# EAGLE design picoAvaR8 (EAGLE 6.1)
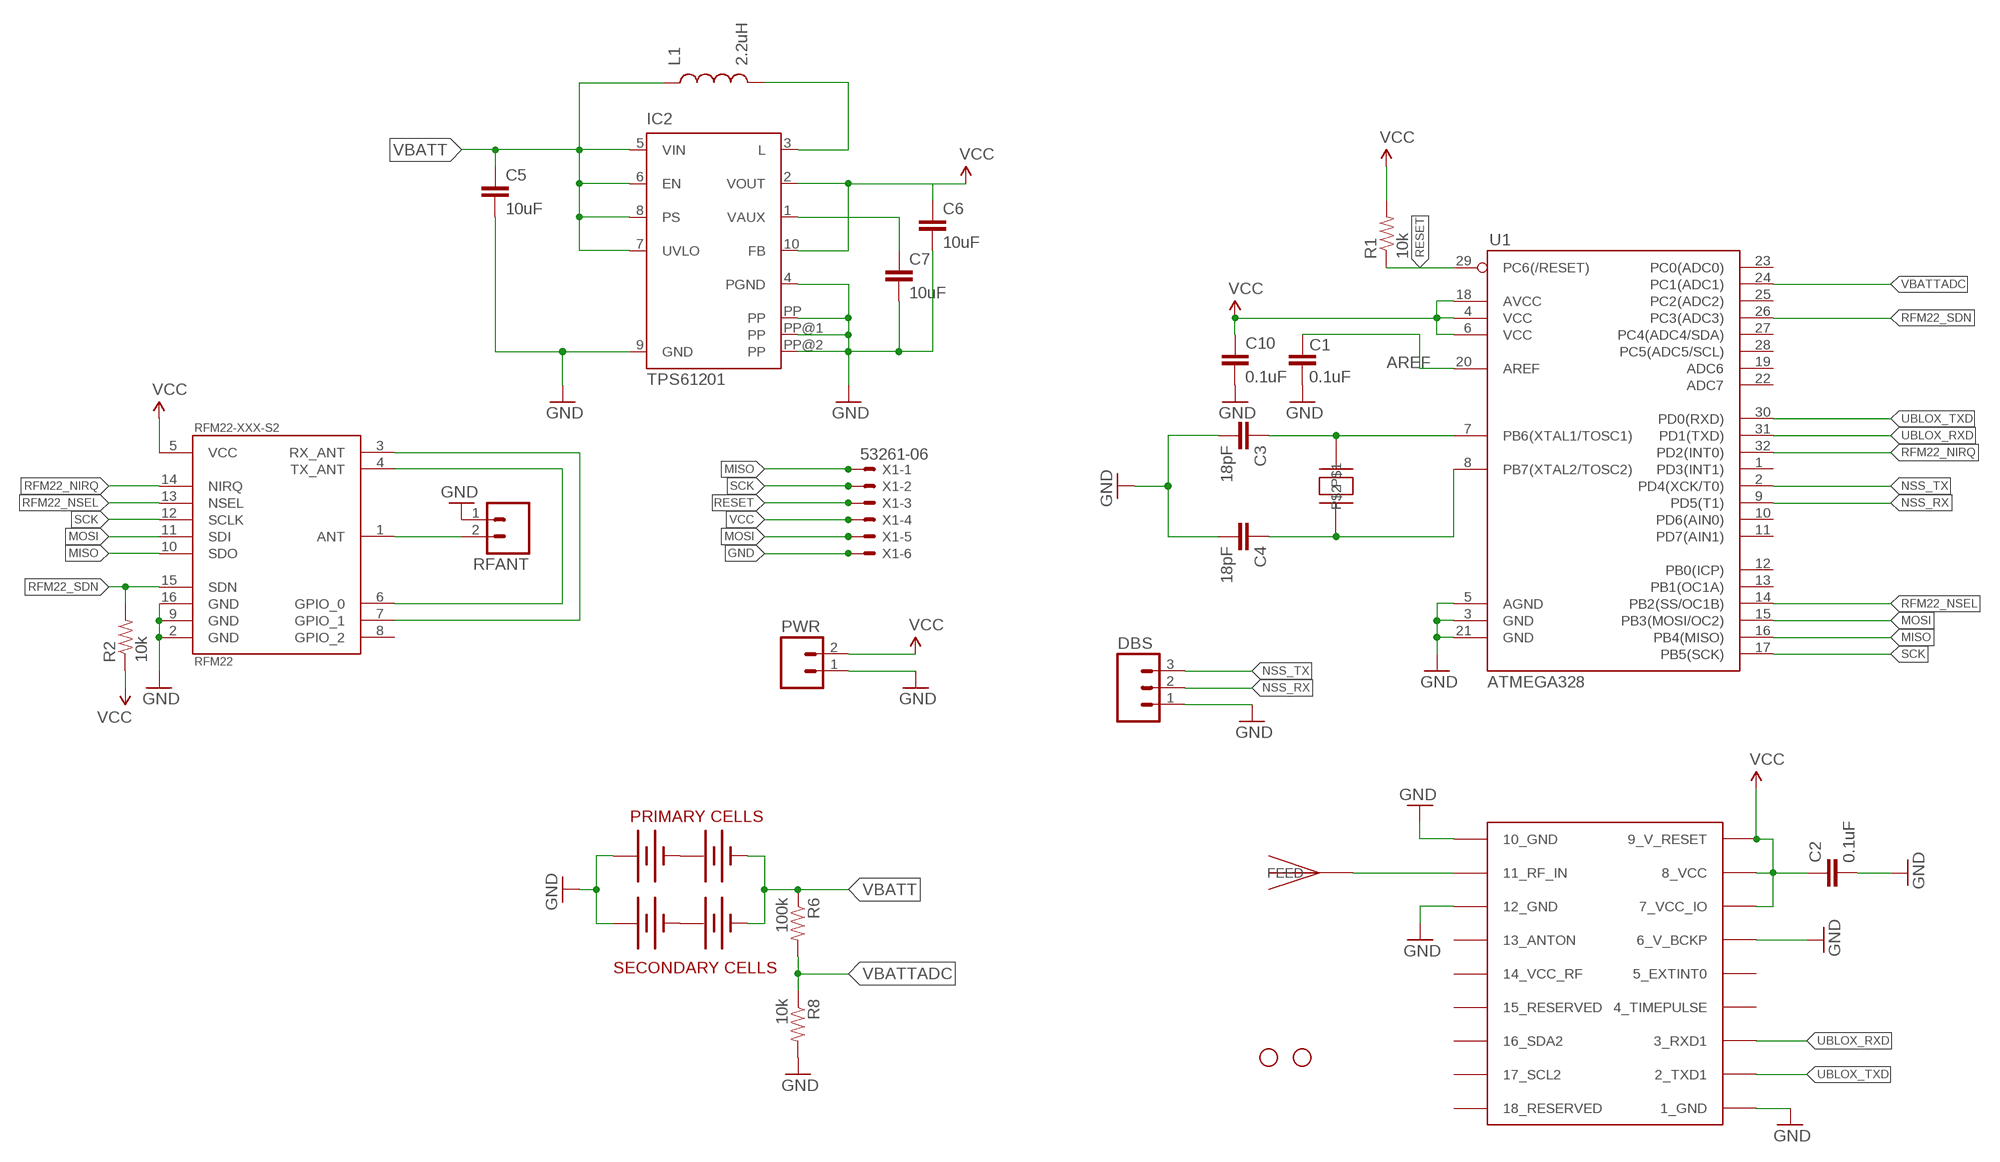
[diagram p0: schematic, sheet 1]

## Parts
C1  0.1uF  CAP0402-CAP  [0402-CAP]
C2  0.1uF  CAP0402-CAP  [0402-CAP]
C3  18pF  CAP0402-CAP  [0402-CAP]
C4  18pF  CAP0402-CAP  [0402-CAP]
C5  10uF  CAP1206  [1206]
C6  10uF  CAP1206  [1206]
C7  10uF  CAP1206  [1206]
C10  0.1uF  CAP0402-CAP  [0402-CAP]
DBS  M03PTH  [1X03]
IC2  TPS61201  [S-PDSO-N10]
JP1  STAND-OFF  [STAND-OFF]
JP2  STAND-OFF  [STAND-OFF]
L1  2.2uH  ELLVGG_INDUCTOR  [ELLVGG_INDUCTOR]
PC1  PC1  TEST  [TEST]
PC2  TEST  [TEST]
PWR  M02PTH  [1X02]
R1  10k  RESISTOR0402-RES  [0402-RES]
R2  10k  RESISTOR0402-RES  [0402-RES]
R6  100k  RESISTOR0402-RES  [0402-RES]
R8  10k  RESISTOR0402-RES  [0402-RES]
RFANT  M02PTH  [1X02]
RFM22-XXX-S2  RFM22  [RFM22-XXX-S2]
SC1  TEST  [TEST]
SC2  TEST  [TEST]
U1  ATMEGA328  ATMEGA168  [TQFP32-08]
U$1  UBLOX_MAX-6  [UBLOX_MAX-6]
U$2  ABRACON_ABM3_CRYSTAL  [ABRACON_ABM3_CRYSTAL]
U$3  JTI_ANTENNA-1575AT43A40  [JTI_ANTENNA-1575AT43A40]
X1  53261-06  [53261-06]

## Nets
AREF: C1.2 U1.20(AREF)
GND [vcc]: C1.1 C2.2 C3.2 C4.2 C5.2 C6.2 C7.2 C10.2 DBS.1 IC2.4(PGND) IC2.9(GND) IC2.PP IC2.PP@1(PP) IC2.PP@2(PP) PC1.VBATT1(+) PC1.VBATT(+) PWR.1 R8.2 RFANT.1 RFM22-XXX-S2.2(GND) RFM22-XXX-S2.9(GND) RFM22-XXX-S2.16(GND) SC1.VBATT1(+) SC1.VBATT(+) U1.3(GND) U1.5(AGND) U1.21(GND) U$1.1_GND U$1.6_V_BCKP U$1.10_GND U$1.12_GND X1.6
MISO: RFM22-XXX-S2.10(SDO) U1.16(PB4(MISO)) X1.1
MOSI: RFM22-XXX-S2.11(SDI) U1.15(PB3(MOSI/OC2)) X1.5
N$2: SC1.GND2(-) SC1.GND(-) SC2.VBATT1(+) SC2.VBATT(+)
N$3: RFANT.2 RFM22-XXX-S2.1(ANT)
N$4: U$1.11_RF_IN U$3.FEED
N$5: RFM22-XXX-S2.3(RX_ANT) RFM22-XXX-S2.7(GPIO_1)
N$6: RFM22-XXX-S2.4(TX_ANT) RFM22-XXX-S2.6(GPIO_0)
N$7: IC2.3(L) L1.P$2
N$8: PC1.GND2(-) PC1.GND(-) PC2.VBATT1(+) PC2.VBATT(+)
N$9: C3.1 U1.7(PB6(XTAL1/TOSC1)) U$2.P$2
N$10: C4.1 U1.8(PB7(XTAL2/TOSC2)) U$2.P$1
N$11: C7.1 IC2.1(VAUX)
NSS_RX: DBS.2 U1.9(PD5(T1))
NSS_TX: DBS.3 U1.2(PD4(XCK/T0))
RESET: R1.1 U1.29(PC6(/RESET)) X1.3
RFM22_NIRQ: RFM22-XXX-S2.14(NIRQ) U1.32(PD2(INT0))
RFM22_NSEL: RFM22-XXX-S2.13(NSEL) U1.14(PB2(SS/OC1B))
RFM22_SDN: R2.2 RFM22-XXX-S2.15(SDN) U1.26(PC3(ADC3))
SCK: RFM22-XXX-S2.12(SCLK) U1.17(PB5(SCK)) X1.2
UBLOX_RXD: U1.31(PD1(TXD)) U$1.3_RXD1
UBLOX_TXD: U1.30(PD0(RXD)) U$1.2_TXD1
VBATT [vcc]: C5.1 IC2.5(VIN) IC2.6(EN) IC2.7(UVLO) IC2.8(PS) L1.P$1 PC2.GND2(-) PC2.GND(-) R6.1 SC2.GND2(-) SC2.GND(-)
VBATTADC: R6.2 R8.1 U1.24(PC1(ADC1))
VCC: C2.1 C6.1 C10.1 IC2.2(VOUT) IC2.10(FB) PWR.2 R1.2 R2.1 RFM22-XXX-S2.5(VCC) U1.4(VCC) U1.6(VCC) U1.18(AVCC) U$1.7_VCC_IO U$1.8_VCC U$1.9_V_RESET X1.4
Unconnected: RFM22-XXX-S2.8(GPIO_2) U1.1(PD3(INT1)) U1.10(PD6(AIN0)) U1.11(PD7(AIN1)) U1.12(PB0(ICP)) U1.13(PB1(OC1A)) U1.19(ADC6) U1.22(ADC7) U1.23(PC0(ADC0)) U1.25(PC2(ADC2)) U1.27(PC4(ADC4/SDA)) U1.28(PC5(ADC5/SCL)) U$1.4_TIMEPULSE U$1.5_EXTINT0 U$1.13_ANTON U$1.14_VCC_RF U$1.15_RESERVED U$1.16_SDA2 U$1.17_SCL2 U$1.18_RESERVED

## Notes on the sheet
- PRIMARY CELLS
- SECONDARY CELLS

## Library data of the parts
C1-C7 C10 = SparkFun:CAP: Capacitor Standard 0603 ceramic capacitor, and 0.1" leaded capacitor.
DBS = SparkFun:M03: Header 3 Standard 3-pin 0.1" header. Use with straight break away headers (SKU : PRT-00116), right angle break away headers (PRT-00553), swiss pins (PRT-00743), machine pins (PRT-00117), and female headers (PRT-00115). Molex polarized connector foot print use with SKU : PRT-08232 with associated crimp pins and housings.
IC2 = texas:TPS6120*: LOW INPUT VOLTAGE SYNCHRONOUS BOOST CONVERTER WITH 1.3-A SWITCHES Source: http://focus.ti.com/lit/ds/symlink/tps61200.pdf; MPN: TPS61201DRCT; OC_FARNELL: unknown; OC_NEWARK: 37M0068
JP1 JP2 = SparkFun:STAND-OFF: Stand Off This is the mechanical footprint for a #4 phillips button head screw. Use the keepout ring to avoid running the screw head into surrounding components. SKU : PRT-00447
L1 = ava:ELLVGG_INDUCTOR
PC1 PC2 SC1 SC2 = ava:TEST
PWR RFANT = SparkFun:M02: Header 2 Standard 2-pin 0.1" header. Use with straight break away headers (SKU : PRT-00116), right angle break away headers (PRT-00553), swiss pins (PRT-00743), machine pins (PRT-00117), and female headers (PRT-00115). Molex polarized connector foot print use with SKU : PRT-08233 with associated crimp pins and housings.
R1 R2 R6 R8 = SparkFun:RESISTOR: Resistor Basic schematic elements and footprints for 0603, 1206, and PTH resistors.
RFM22-XXX-S2 = SparkFun:RFM22: *Hope RF's RFM22* Packages: RFM22-S2 (SMD)
U1 = SparkFun:ATMEGA168
U$1 = ava:UBLOX_MAX-6: UBLOX MAX-6
U$2 = ava:ABRACON_ABM3_CRYSTAL
U$3 = ava:JTI_ANTENNA-1575AT43A40
X1 = con-molex:53?-06: CONNECTOR wire to board 1.25 mm (.049 inch) pitch header; OC_FARNELL: 1125375; OC_NEWARK: unknown

## Net classes
0 default: width 0.203 mm
1 vcc: width 0.254 mm

## Board
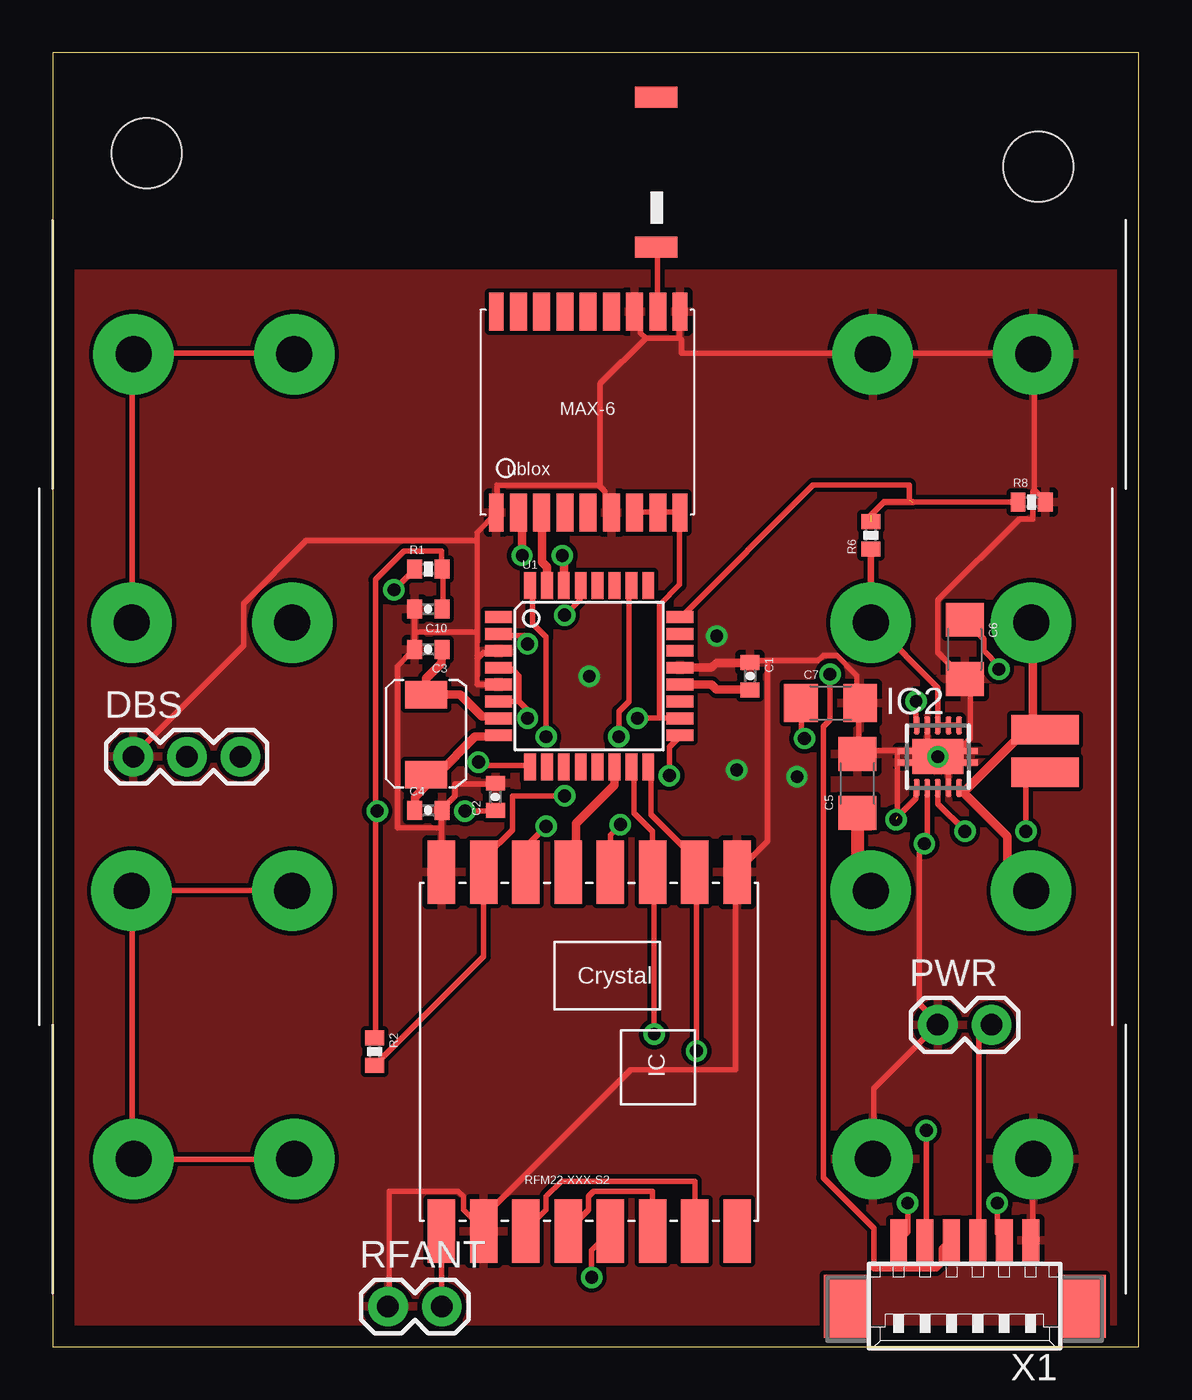
[diagram p1: board, top side]
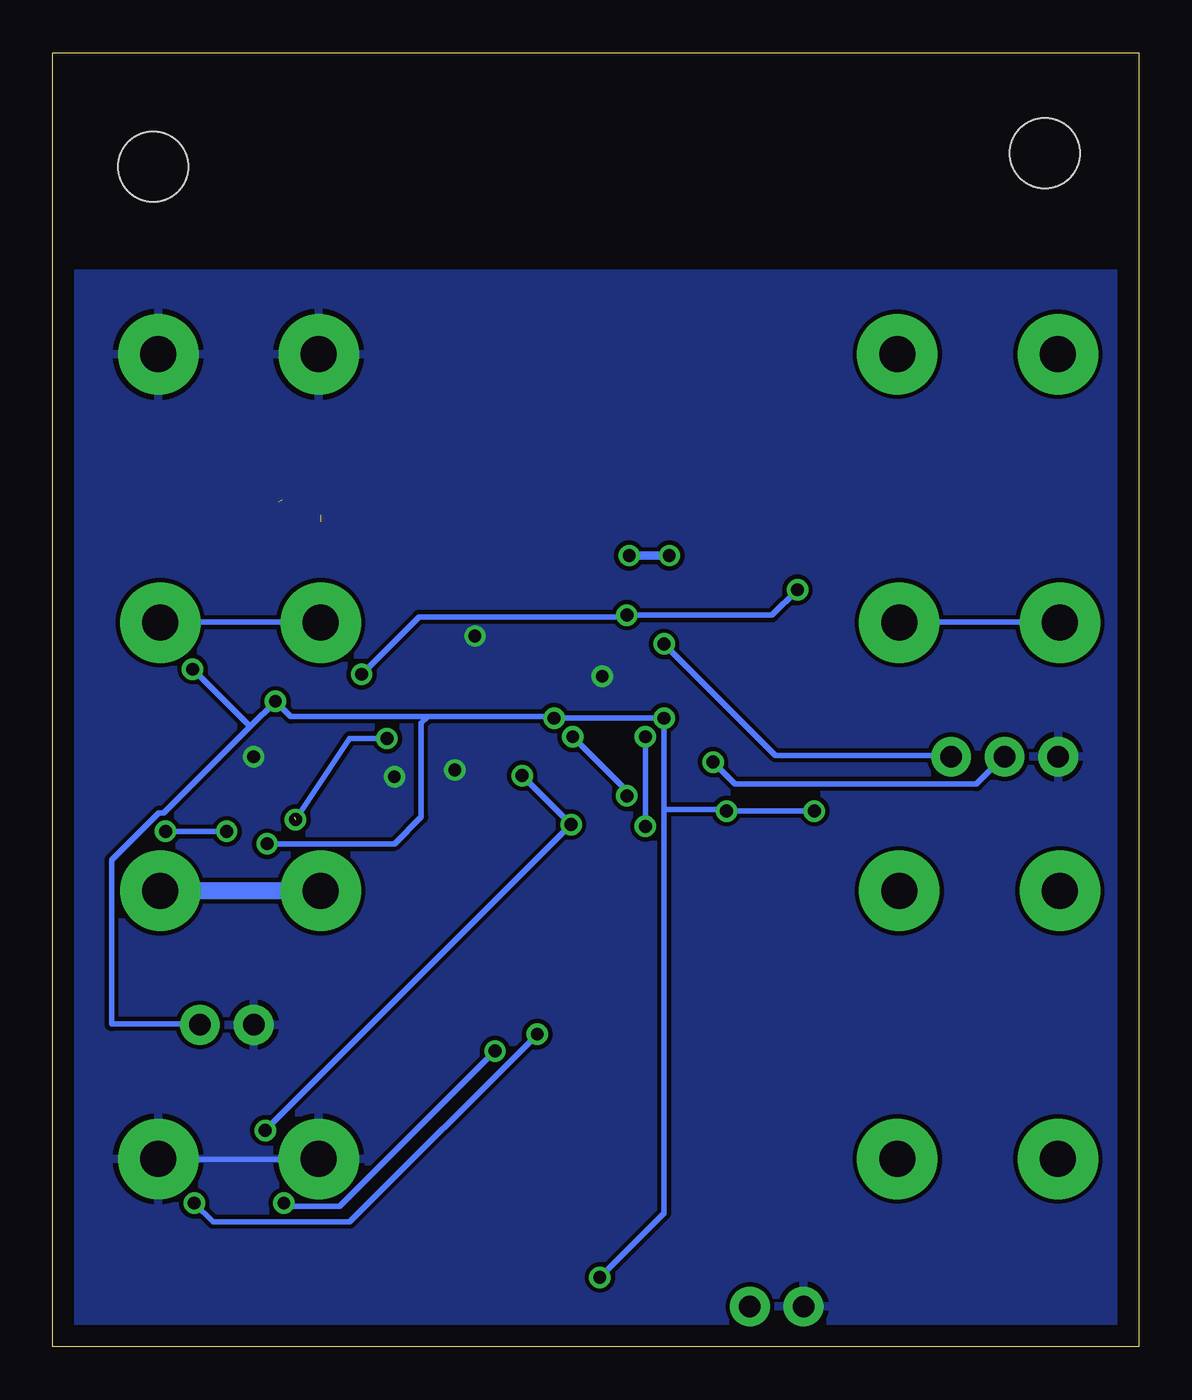
[diagram p2: board, bottom side, seen from below]

Size 51.42 x 61.27 mm. Coordinates in mm from the lower left corner, seen from the top.
Outline: 0,0 51.42,0 51.42,61.27 0,61.27 0,0
Copper layers (1*16): Top 0.035mm / dielectric 1.5mm / Bottom 0.035mm
Design rules: minimum track width 10mil, minimum drill 24mil, track to track 8mil, track to pad 8mil, pad to pad 8mil, via to via 8mil, smd to smd 8mil, copper to edge 40mil, drill to drill 8mil, minimum pad ring 10mil, minimum via ring 8mil, stop-mask expansion 4mil, vias tented up to drill 0mil, thermal gap 10mil

### Footprints (pad centres in the part's own frame; a part is rotated, then mirrored left to right if it is on the bottom)
0402-CAP = smd 0.7 x 0.9: 1 -0.65,0; 2 0.65,0
1206 = smd 1.6 x 1.8: 1 -1.4,0; 2 1.4,0
1X03 = drill 1.016 pad 1.88: 1 0,0; 2 2.54,0; 3 5.08,0
S-PDSO-N10 = smd 0.28 x 0.85: 1 -1,-1.475; 2 -0.5,-1.475; 3 0,-1.475; 4 0.5,-1.475; 5 1,-1.475; 6 1,1.475; 7 0.5,1.475; 8 0,1.475; 9 -0.5,1.475; 10 -1,1.475 | smd 2.4 x 1.65: PP 0,0 | smd 3.8 x 0.28: PP@1 0,0.275; PP@2 0,-0.275
STAND-OFF = hole 3.302: 0,0
ELLVGG_INDUCTOR = smd 1.4 x 3.2: P$1 -3.81,0; P$2 -1.81,0
TEST = drill 1.7 pad 3.81: GND -21.57,0; GND2 -13.97,0; VBATT 13.43,0; VBATT1 21.03,0
1X02 = drill 1.016 pad 1.88: 1 0,0; 2 2.54,0
0402-RES = smd 0.7 x 0.9: 1 -0.65,0; 2 0.65,0
RFM22-XXX-S2 = smd 3 x 1.3: 1 -8.5,7; 2 -8.5,5; 3 -8.5,3; 4 -8.5,1; 5 -8.5,-1; 6 -8.5,-3; 7 -8.5,-5; 8 -8.5,-7; 9 8.5,-7; 10 8.5,-5; 11 8.5,-3; 12 8.5,-1; 13 8.5,1; 14 8.5,3; 15 8.5,5; 16 8.5,7
TQFP32-08 = smd 1.27 x 0.559: 1 -4.293,2.8; 2 -4.293,2; 3 -4.293,1.2; 4 -4.293,0.4; 5 -4.293,-0.4; 6 -4.293,-1.2; 7 -4.293,-2; 8 -4.293,-2.8; 17 4.293,-2.8; 18 4.293,-2; 19 4.293,-1.2; 20 4.293,-0.4; 21 4.293,0.4; 22 4.293,1.2; 23 4.293,2; 24 4.293,2.8 | smd 0.559 x 1.27: 9 -2.8,-4.293; 10 -2,-4.293; 11 -1.2,-4.293; 12 -0.4,-4.293; 13 0.4,-4.293; 14 1.2,-4.293; 15 2,-4.293; 16 2.8,-4.293; 25 2.8,4.293; 26 2,4.293; 27 1.2,4.293; 28 0.4,4.293; 29 -0.4,4.293; 30 -1.2,4.293; 31 -2,4.293; 32 -2.8,4.293
UBLOX_MAX-6 = smd 1.8 x 0.7: 1_GND 4.95,-4.4; 9_V_RESET 4.95,4.3; 10_GND -4.55,4.3; 18_RESERVED -4.55,-4.4 | smd 1.8 x 0.8: 2_TXD1 4.95,-3.35; 3_RXD1 4.95,-2.25; 4_TIMEPULSE 4.95,-1.15; 5_EXTINT0 4.95,-0.05; 6_V_BCKP 4.95,1.05; 7_VCC_IO 4.95,2.15; 8_VCC 4.95,3.25; 11_RF_IN -4.55,3.25; 12_GND -4.55,2.15; 13_ANTON -4.55,1.05; 14_VCC_RF -4.55,-0.05; 15_RESERVED -4.55,-1.15; 16_SDA2 -4.55,-2.25; 17_SCL2 -4.55,-3.35
ABRACON_ABM3_CRYSTAL = smd 1.3 x 2: P$1 -3.4,0.1; P$2 0.4,0.1
JTI_ANTENNA-1575AT43A40 = smd 1 x 2: FEED -3.81,-1.27; NC 3.29,-1.27
53261-06 = smd 0.8 x 2: 1 3.125,-2.5; 2 1.875,-2.5; 3 0.625,-2.5; 4 -0.625,-2.5; 5 -1.875,-2.5; 6 -3.125,-2.5 | smd 2.1 x 3: S1 5.625,0.625; S2 -5.625,0.625

### Placement (x,y rotation side)
C1  33.02,31.75 270 top
C2  20.95,26.04 90 top
C3  17.78,33.02 180 top
C4  17.78,25.4 0 top
C5  38.1,26.67 90 top
C6  43.18,33.02 270 top
C7  36.83,30.48 0 top
C10  17.78,34.92 180 top
DBS  3.81,27.94 0 top
IC2  41.91,27.94 0 top
JP1  4.45,56.52 0 top
JP2  46.67,55.88 0 top
L1  46.99,25.4 270 top
PC1  25.4,8.89 0 top
PC2  24.77,21.59 180 top
PWR  41.91,15.24 0 top
R1  17.78,36.83 0 top
R2  15.24,13.97 270 top
R6  38.73,38.42 90 top
R8  46.35,40.01 0 top
RFANT  15.88,1.91 0 top
RFM22-XXX-S2  25.4,13.97 90 top
SC1  25.4,46.99 0 top
SC2  24.77,34.29 180 top
U1  25.4,31.75 0 top
U$1  25.4,44.45 270 top
U$2  17.78,30.48 90 top
U$3  27.3,55.88 90 top
X1  43.18,2.54 180 top

### Tracks (layer width: path | path; a pad name or v marks a point on that pad's centre or on a via)
AREF
  Top 0.406: U1.20 31.2,31.35 31.43,31.11 33.01,31.11 C1.2
GND  (via drill 0.6)
  Top 0.254: X1.6 46.32,5.04 46.4,5.12 46.4,8.88 PC1.VBATT1 | PC1.VBATT 38.88,8.96 38.88,12.24 41.84,15.2 PWR.1 41.92,15.36 41.04,16.24 41.04,23.92 | RFANT.1 15.92,1.92 15.92,7.36 19.2,7.36 19.44,7.12 19.44,6.48 20.4,5.52 RFM22-XXX-S2.2 20.16,5.92 27.36,13.12 32.32,13.12 32.32,22.4 RFM22-XXX-S2.9 33.84,23.92 33.84,32.48 | IC2.4 42.4,26.48 42.4,27.12 41.92,27.6 IC2.PP | IC2.PP 42.16,27.52 43.44,28.8 43.44,31.36 C6.2 41.92,32.88 41.92,35.36 45.76,39.2 46.4,39.2 46.4,40.48 46.48,40.56 | IC2.PP@2 IC2.PP | IC2.PP@1 41.92,28.16 41.92,28 IC2.PP | 33.84,32.48 36.24,32.48 36.48,32.72 37.12,32.72 38.08,31.76 38.08,30.56 C7.2 38.16,30.48 38.16,28.08 C5.2 38.24,28.24 40,28.24 | 33.84,32.48 33.2,32.48 C1.1 | 40,28.24 41.84,28.24 IC2.PP@1 | 40,28.24 40,24.96 | 46.48,40.56 46.96,40.08 R8.2 | 46.48,40.56 46.48,46.96 SC1.VBATT1 46.32,47.04 38.88,47.04 SC1.VBATT 38.72,47.04 29.76,47.04 29.76,47.68 29.68,47.76 | RFM22-XXX-S2.16 18.4,24.56 | 18.4,24.56 18.4,25.36 C4.2 18.48,25.52 19.04,26.08 19.04,26.64 20.88,26.64 C2.2 | 28.08,47.76 27.84,48 27.84,48.72 27.6,48.96 U$1.12_GND | 29.68,47.76 28.08,47.76 | 29.68,47.76 29.68,48.96 U$1.10_GND | 17.12,33.84 17.12,34.88 C10.2 | 17.12,33.84 17.12,33.04 C3.2 17.04,32.96 16.32,32.24 16.32,24.56 18.4,24.56 | 20.16,32.64 20.4,32.88 21.04,32.88 U1.3 | 20.16,32.64 20.08,32.56 20.08,31.36 21.04,31.36 U1.5 | 20.08,33.84 17.12,33.84 | 20.08,33.84 20.08,32.72 20.16,32.64 | 20.08,33.84 20.08,38.16 | 20.08,38.16 20.08,38.56 20.96,39.44 U$1.1_GND 21.04,39.6 21.04,40.8 25.84,40.8 | 25.84,40.8 26.16,40.48 26.16,39.76 26.4,39.52 U$1.6_V_BCKP | 28.08,47.76 25.92,45.6 25.92,40.88 25.84,40.8
  Top 0.254: 20.08,38.16 12,38.16 9.04,35.2 9.04,33.2 3.84,28 DBS.1 | IC2.9 41.41,28.71 IC2.PP@1
  Top 0.406: U1.21 31.2,32.15 31.43,32.38 33.01,32.38 C1.1
  Bottom 0.254: PC1.VBATT1 46.4,8.88 38.88,8.88 PC1.VBATT
  other vias: 31.43,33.66 25.4,31.75 32.38,27.3 35.24,26.99 41.91,27.94
  pour Top: 0.32,50.8 50.8,50.8 50.8,0 0.32,0
  pour Bottom: 0.32,50.8 50.8,50.8 50.8,0 0.32,0
MISO  (via drill 0.61)
  Top 0.254: U1.16 28.24,27.44 28.32,27.36 28.32,25.2 30.4,23.12 RFM22-XXX-S2.10 30.48,22.4 v30.48,14 | v40.48,6.8 40.48,5.44 40.08,5.04 X1.1
  Bottom 0.254: v40.48,6.8 40.32,6.64 37.84,6.64 v30.48,14
MOSI  (via drill 0.61)
  Top 0.254: U1.15 27.44,27.44 27.52,27.36 27.52,25.28 28.4,24.4 RFM22-XXX-S2.11 28.48,22.4 v28.48,14.8 | v44.72,6.8 44.72,5.36 X1.5
  Bottom 0.254: v44.72,6.8 43.84,5.92 37.36,5.92 v28.48,14.8
N$2
  Top 0.254: SC1.GND2 11.36,47.04 3.84,47.04 SC1.GND 3.76,46.88 3.76,34.32 SC2.VBATT1
  Bottom 0.254: SC2.VBATT1 3.76,34.32 11.28,34.32 SC2.VBATT
N$3
  Top 0.254: RFM22-XXX-S2.1 RFANT.2
N$4
  Top 0.254: U$1.11_RF_IN 28.64,49.04 28.64,52 U$3.FEED
N$5
  Top 0.254: RFM22-XXX-S2.7 30.4,7.84 24.08,7.84 23.36,7.12 23.36,6.48 22.4,5.52 RFM22-XXX-S2.3
N$6
  Top 0.254: RFM22-XXX-S2.6 28.4,7.36 25.6,7.36 25.36,7.12 25.36,6.48 24.4,5.52 RFM22-XXX-S2.4
N$7  (via drill 0.61)
  Top 0.254: v46.08,24.4 46.08,27.12 46.16,27.2 46.96,27.2 L1.P$2 | IC2.3 41.92,26.4 41.92,25.71 43.19,24.44 v43.19,24.4
  Bottom 0.254: v46.08,24.4 v43.19,24.4
N$8
  Top 0.254: PC2.VBATT 11.28,21.6 3.76,21.6 PC2.VBATT1 3.76,21.52 3.76,8.96 PC1.GND 11.36,8.88 PC1.GND2
N$9
  Top 0.254: U1.7 20.95,29.84
  Top 0.406: 20.95,29.84 20.32,29.84 19.29,30.88 U$2.P$2 17.68,31.65 18.41,32.38 18.41,33.01 C3.1
N$10
  Top 0.406: U1.8 21.05,28.89 20,28.89 18.19,27.08 U$2.P$1 17.68,26.57 17.14,26.04 17.14,25.41 C4.1
N$11  (via drill 0.61)  (1 unrouted)
  Top 0.254: v35.6,28.8 35.44,28.96 C7.1 | IC2.1 40.88,26.4 40.88,25.96 40.01,25.08
  Bottom 0.254: v39.93,24.96 37.36,28.8 v35.6,28.8
NSS_RX  (via drill 0.61)
  Top 0.254: v20.16,27.68 20.16,27.52 22.56,27.52 U1.9
  Bottom 0.254: v20.16,27.68 19.12,26.64 7.68,26.64 6.4,27.92 DBS.2
NSS_TX  (via drill 0.61)
  Top 0.254: v22.48,33.28 22.48,33.68 21.12,33.68 U1.2
  Bottom 0.254: v22.48,33.28 17.2,28 8.96,28 DBS.3
RESET  (via drill 0.61)
  Top 0.254: v16.16,35.84 17.12,36.8 R1.1 | v24.24,34.64 24.96,35.36 24.96,36 U1.29 | v36.8,31.84 36.8,29.68 36.48,29.36 36.48,8 38.88,5.6 38.88,3.68 41.84,3.68 42.08,3.92 42.08,4.64 42.48,5.04 X1.3
  Bottom 0.254: v16.16,35.84 17.36,34.64 v24.24,34.64 24.32,34.56 34.08,34.56 v36.8,31.84
RFM22_NIRQ  (via drill 0.61)
  Top 0.254: v23.36,28.88 23.36,33.6 22.72,34.24 22.72,35.92 22.64,36 U1.32 | v23.36,24.64 22.4,23.68 RFM22-XXX-S2.14
  Bottom 0.254: v23.36,24.64 v23.36,28.88
RFM22_NSEL
  Top 0.406: U1.14 26.6,26.6 24.77,24.77 24.77,22.84 RFM22-XXX-S2.13
RFM22_SDN  (via drill 0.61)
  Top 0.254: R2.2 20.4,18.48 RFM22-XXX-S2.15 20.48,22.56 20.48,23.2 21.76,24.48 21.76,26.08 v24.24,26.08 | v26.8,28.88 26.8,30.08 27.28,30.56 27.28,35.92 27.36,36 U1.26
  Bottom 0.254: v26.8,28.88 24.24,26.32 v24.24,26.08
SCK  (via drill 0.61)
  Top 0.254: v29.2,27.04 29.2,28.4 29.68,28.88 U1.17 | v26.88,24.72 26.4,24.24 RFM22-XXX-S2.12 | v41.36,10.24 41.36,5.04 X1.2
  Bottom 0.254: v29.2,27.04 v26.88,24.72 v41.36,10.24
UBLOX_RXD
  Top 0.406: U1.31 23.4,36.92 23.18,37.15 23.18,39.47 U$1.3_RXD1
UBLOX_TXD  (via drill 0.6)
  Top 0.406: U1.30 24.2,37.4 v24.13,37.47 | v22.23,37.47 22.23,39.33 U$1.2_TXD1
  Bottom 0.406: v24.13,37.47 v22.23,37.47
VBATT
  Top 0.254: 38.72,24.64 38.16,25.2 C5.1 | PC2.GND2 | 43.12,26.24 42.96,26.4 IC2.5 | 46.32,21.6 PC2.GND | IC2.6 42.88,29.44 42.48,29.44 IC2.7 42.4,29.44 41.92,29.44 IC2.8 41.92,29.52 41.92,31.2 38.88,34.24 SC2.GND2 38.8,34.32 | 46.4,29.84 46.96,29.28 L1.P$1 46.48,29.6 | 46.4,34.24 SC2.GND
  Top 0.3: R6.1 SC2.GND2
  Top 0.406: 46.32,21.6 45.2,22.72 45.2,24.16 43.12,26.24 46.48,29.6 | 46.4,34.24 46.4,29.84 | 38.72,24.64 38.1,24.64
  Top 0.61: 38.1,24.64 38.1,22.23 PC2.GND2
  Bottom 0.254: 38.8,21.6 PC2.GND2 | 46.32,21.6 PC2.GND | SC2.GND2 38.8,34.32 46.32,34.32 SC2.GND
  Bottom 0.813: 46.32,21.6 38.8,21.6
VBATTADC  (2 unrouted)
  Top 0.254: 40.72,40 45.68,40 R8.1 | 40.56,40.08 40.56,40.8 36,40.8 29.76,34.56 U1.24
  Top 0.3: 40.72,40 39.37,40 38.73,39.37
VCC  (via drill 0.6, 0.61)
  Top 0.254: v40.88,30.56 40.88,29.44 IC2.10 | C6.1 44.08,33.52 44.08,32.96 44.8,32.24 v44.8,32.08 | X1.4 43.84,5.04 43.84,14.64 44.4,15.2 PWR.2 | U$1.7_VCC_IO 27.6,39.52 28.64,39.52 U$1.8_VCC 28.72,39.52 29.6,39.52 U$1.9_V_RESET 29.68,39.44 29.68,36.08 28.72,35.12 28.72,29.76 | 28.72,29.76 U1.18 | 22.08,30.56 U1.6 | 22.08,30.56 22.08,31.76 21.76,32.08 21.12,32.08 U1.4 | 15.28,25.36 15.28,36.32 16.64,37.68 18.4,37.68 18.4,36.88 R1.2 18.48,36.72 18.48,34.96 C10.1 | 15.28,25.36 15.28,14.64 R2.1 | v19.52,25.36 20.88,25.36 C2.1 | v15.36,25.36 15.28,25.36 | 22.08,30.56 22.48,30.16 v22.48,29.76 | v25.52,3.28 25.52,4.56 26.4,5.44 RFM22-XXX-S2.5 | v27.68,29.76 28.72,29.76 | IC2.2 41.41,23.95 v41.27,23.81
  Bottom 0.254: 42.08,29.36 46.16,25.28 46.4,25.28 48.64,23.04 48.64,15.28 44.48,15.28 PWR.2 | 42.08,29.36 v40.88,30.56 40.16,29.84 33.66,29.84 | 42.08,29.36 v44.8,32.08 | v15.36,25.36 v19.52,25.36 19.6,25.44 22.48,25.44 | 22.48,25.44 v22.48,29.76 v27.68,29.76 27.76,29.84 33.66,29.84 | v25.52,3.28 22.48,6.32 22.48,25.44 | v41.27,23.81 35.24,23.81 33.97,25.08 33.97,29.52 33.66,29.84